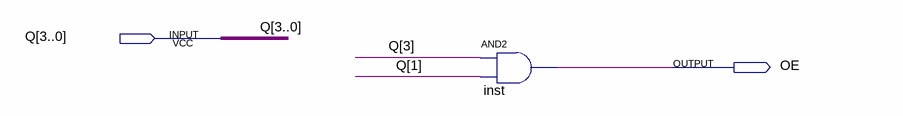
[diagram p0: schematic sheet]
// Quartus schematic OE.bdf as structural Verilog: 1 symbols, 2 pins
module OE (
  input  [3:0] Q,
  output OE
);

  and inst (OE, Q[3], Q[1]);
endmodule
